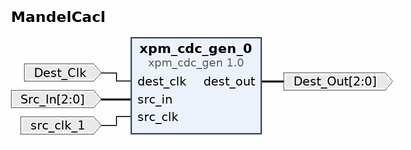
[diagram p0: block diagram of the top level]
# Vivado block design MandelCacl, xc7z015clg485-2, Vivado 2024.2
create_bd_design MandelCacl

create_bd_port -dir I -type clk src_clk_1
set_property -dict {CONFIG.FREQ_HZ 125000000} [get_bd_ports src_clk_1]
create_bd_port -dir I -type clk Dest_Clk
set_property -dict {CONFIG.FREQ_HZ 48000000} [get_bd_ports Dest_Clk]
create_bd_port -dir O -from 2 -to 0 -type data Dest_Out
create_bd_port -dir I -from 2 -to 0 Src_In

create_bd_cell -type ip -vlnv xilinx.com:ip:xpm_cdc_gen:1.0 xpm_cdc_gen_0
set_property -dict {CONFIG.CDC_TYPE xpm_cdc_array_single CONFIG.WIDTH 3} [get_bd_cells xpm_cdc_gen_0]

# ---- connections ----

connect_bd_net [get_bd_ports Dest_Clk] [get_bd_pins xpm_cdc_gen_0/dest_clk]
connect_bd_net [get_bd_ports Src_In] [get_bd_pins xpm_cdc_gen_0/src_in]
connect_bd_net -net src_clk_1_1 [get_bd_ports src_clk_1] [get_bd_pins xpm_cdc_gen_0/src_clk]
connect_bd_net [get_bd_pins xpm_cdc_gen_0/dest_out] [get_bd_ports Dest_Out]

validate_bd_design
save_bd_design
